# EAGLE design Goldfish-Voiceboard (EAGLE 6.5.0)

## Sheet 1 of 3
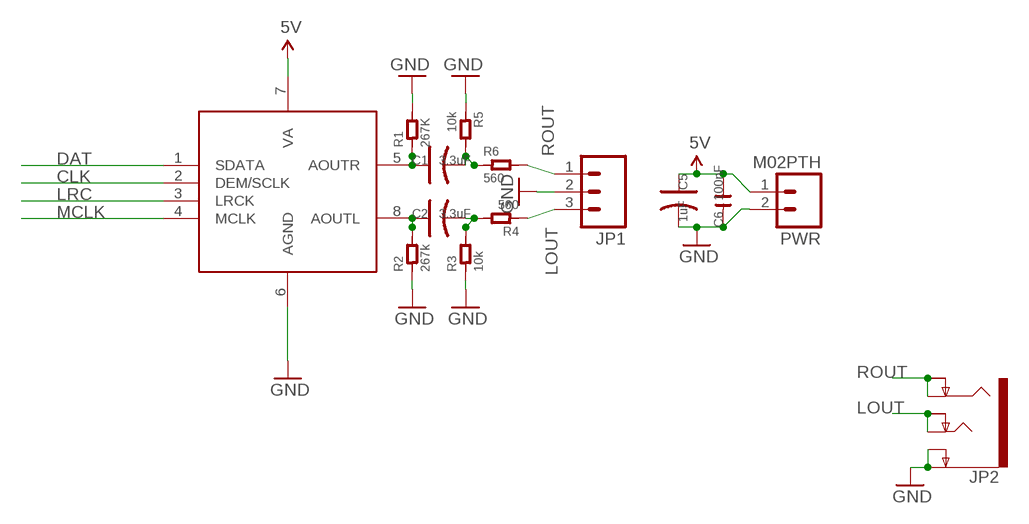
[diagram p0: schematic, sheet 1]

### Parts
C1  3.3uF  C-POLAR-A  [AVX-A]
C2  3.3uF  C-POLAR-A  [AVX-A]
C5  1uF  C-POLAR-A  [AVX-A]
C6  100nF  C-0603  [C0603]
JP1  M03PTH  [1X03]
JP2  AUDIO-JACK4-.25-HORIZ-TRS  [AUDIO-JACK-.25-INCH-HORIZ-PTH]
PWR  M02PTH  [1X02]
R1  267K  R-0603  [R0603]
R2  267k  R-0603  [R0603]
R3  10k  R-0603  [R0603]
R4  560  R-0603  [R0603]
R5  10k  R-0603  [R0603]
R6  560  R-0603  [R0603]
U$1  CS4335-KSZ  [SOIC8_208MIL]

### Nets
5V [5V]: C5.+ C6.2 PWR.1 U$1.7(VA) ; also sheet 2
CLK: U$1.2(DEM/SCLK) ; also sheet 2
DAT: U$1.1(SDATA) ; also sheet 2
GND: C5.- C6.1 JP1.2 JP2.P$2(EARTH) JP2.P$3(EARTH-NORM) PWR.2 R1.2 R2.1 R3.1 R5.1 U$1.6(AGND) ; also sheet 2
LOUT [MEDIUMAUDIO]: JP1.3 JP2.P$6(TIP) JP2.P$7(TIP-NORM) R4.1
LRC: U$1.3(LRCK) ; also sheet 2
MCLK: U$1.4(MCLK) ; also sheet 2
N$13 [MEDIUMAUDIO]: C1.+ R1.1 U$1.5(AOUTR)
N$14 [MEDIUMAUDIO]: C2.+ R2.2 U$1.8(AOUTL)
N$15 [MEDIUMAUDIO]: C2.- R3.2 R4.2
N$16 [MEDIUMAUDIO]: C1.- R5.2 R6.1
ROUT [MEDIUMAUDIO]: JP1.1 JP2.P$4(RING) JP2.P$5(RING-NORM) R6.2

## Sheet 2 of 3
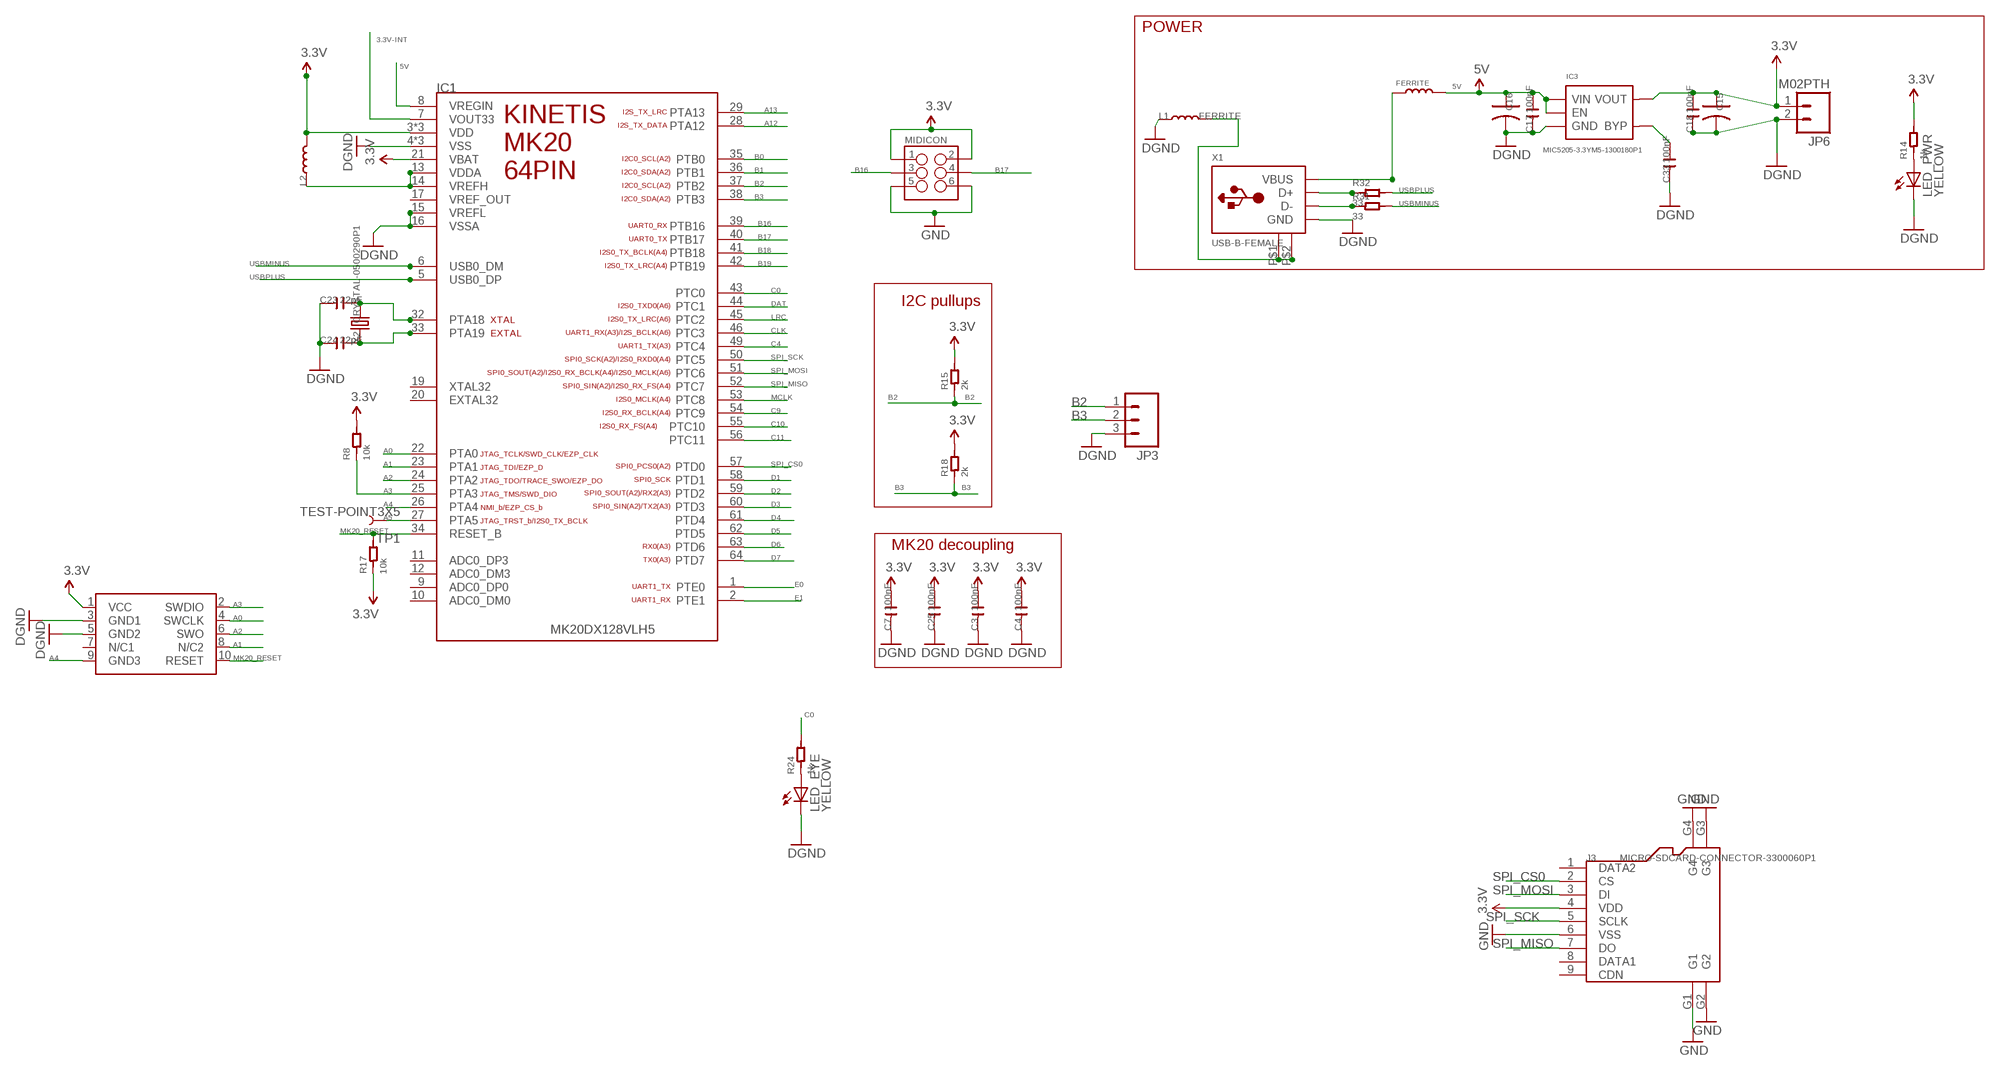
[diagram p1: schematic, sheet 2]

### Parts
C3  100nF  C-0603  [C0603]
C4  100nF  C-0603  [C0603]
C7  100nF  C-0603  [C0603]
C15  C-POLAR-A  [AVX-A]
C16  C-POLAR-A  [AVX-A]
C17  100nF  C-0603  [C0603]
C18  100nF  C-0603  [C0603]
C23  22pF  C-0603  [C0603]
C24  22pF  C-0603  [C0603]
C25  100nF  C-0603  [C0603]
C33  100nF  C-0603  [C0603]
IC1  MK20DX128VLH5  [MK20DX128VLH5]
IC3  MIC5205-3.3YM5-1300180P1  [SOT23-5]
J3  MICRO-SDCARD-CONNECTOR-3300060P1  [9P-SMD-W-RING]
JP3  M03PTH  [1X03]
JP6  M02PTH  [1X02]
L1  FERRITE  L-0603  [L0603]
L2  L-0603  [L0603]
L4  FERRITE  L-0603  [L0603]
LED_EYE  YELLOW  LEDCHIP-LED0603  [CHIP-LED0603]
LED_PWR  YELLOW  LEDCHIP-LED0603  [CHIP-LED0603]
MIDICON  M03X2SMT  [2X3_SMT_POSTS]
R8  10k  R-0603  [R0603]
R14  1k  R-0603  [R0603]
R15  2k  R-0603  [R0603]
R17  10k  R-0603  [R0603]
R18  2k  R-0603  [R0603]
R24  1k  R-0603  [R0603]
R31  33  R-0603  [R0603]
R32  33  R-0603  [R0603]
SWD1  CORTEX_SWD  [M50-3600542]
TP1  TEST-POINT3X5  [PAD.03X.05]
X1  USB-B-FEMALE  [FCI61729]
X2  CRYSTAL-0500290P1  [2P-SMD-5.0X3.2]

### Nets
3.3V: C3.2 C4.2 C7.2 C15.+ C18.2 C25.2 IC1.3(VDD) IC1.21(VBAT) IC1.30(VDD) IC1.48(VDD) IC3.5(VOUT) J3.4(VDD) JP6.1 L2.2 MIDICON.1 MIDICON.2 R8.2 R14.2 R15.2 R17.1 R18.2 SWD1.1(VCC)
3.3V-INT: IC1.7(VOUT33)
5V [5V]: C16.+ C17.2 IC1.8(VREGIN) IC3.1(VIN) IC3.3(EN) L4.2 ; also sheet 1
A0: IC1.22(PTA0) SWD1.4(SWCLK)
A1: IC1.23(PTA1) SWD1.8(N/C2)
A2: IC1.24(PTA2) SWD1.6(SWO)
A3: IC1.25(PTA3) R8.1 SWD1.2(SWDIO)
A4: IC1.26(PTA4) SWD1.9(GND3)
A5: IC1.27(PTA5) TP1.P$1
A12: IC1.28(PTA12)
A13: IC1.29(PTA13)
B0: IC1.35(PTB0)
B1: IC1.36(PTB1)
B2: IC1.37(PTB2) JP3.1 R15.1
B3: IC1.38(PTB3) JP3.2 R18.1
B16: IC1.39(PTB16) MIDICON.3
B17: IC1.40(PTB17) MIDICON.4
B18: IC1.41(PTB18)
B19: IC1.42(PTB19)
C0: IC1.43(PTC0) R24.2
C4: IC1.49(PTC4)
C9: IC1.54(PTC9)
C10: IC1.55(PTC10)
C11: IC1.56(PTC11)
CLK: IC1.46(PTC3) ; also sheet 1
D1: IC1.58(PTD1)
D2: IC1.59(PTD2)
D3: IC1.60(PTD3)
D4: IC1.61(PTD4)
D5: IC1.62(PTD5)
D6: IC1.63(PTD6)
D7: IC1.64(PTD7)
DAT: IC1.44(PTC1) ; also sheet 1
E0: IC1.1(PTE0)
E1: IC1.2(PTE1)
GND: C3.1 C4.1 C7.1 C15.- C16.- C17.1 C18.1 C23.1 C24.1 C25.1 C33.1 IC1.4(VSS) IC1.15(VREFL) IC1.16(VSSA) IC1.31(VSS) IC1.47(VSS) IC3.2(GND) J3.6(VSS) J3.G1 J3.G2 J3.G3 J3.G4 JP3.3 JP6.2 L1.1 LED_EYE.C LED_PWR.C MIDICON.5 MIDICON.6 SWD1.3(GND1) SWD1.5(GND2) X1.4(GND) ; supply symbol labelled DGND ; also sheet 1
LRC: IC1.45(PTC2) ; also sheet 1
MCLK: IC1.53(PTC8) ; also sheet 1
MK20_RESET: IC1.34(RESET_B) R17.2 SWD1.10(RESET)
N$3: L1.2 X1.P$1(GND1) X1.P$2(GND2)
N$4: LED_PWR.A R14.1
N$5 [5V]: L4.1 X1.1(VBUS)
N$9: C23.2 IC1.32(PTA18) X2.2
N$10: C24.2 IC1.33(PTA19) X2.1
N$12: C33.2 IC3.4(BYP)
N$17: LED_EYE.A R24.1
N$33: IC1.13(VDDA) IC1.14(VREFH) L2.1
SPI_CS0: IC1.57(PTD0) J3.2(CS)
SPI_MISO: IC1.52(PTC7) J3.7(DO)
SPI_MOSI: IC1.51(PTC6) J3.3(DI)
SPI_SCK: IC1.50(PTC5) J3.5(SCLK)
USB_N: R32.1 X1.3(D+)
USB_P: R31.1 X1.2(D-)
USBMINUS: IC1.6(USB0_DM) R31.2
USBPLUS: IC1.5(USB0_DP) R32.2
Unconnected: IC1.9(ADC0_DP0) IC1.10(ADC0_DM0) IC1.11(ADC0_DP3) IC1.12(ADC0_DM3) IC1.17(VREF_OUT) IC1.19(XTAL32) IC1.20(EXTAL32) J3.1(DATA2) J3.8(DATA1) J3.9(CDN) SWD1.7(N/C1)

### Notes on the sheet
- POWER
- I2C pullups
- MK20 decoupling

## Sheet 3 of 3
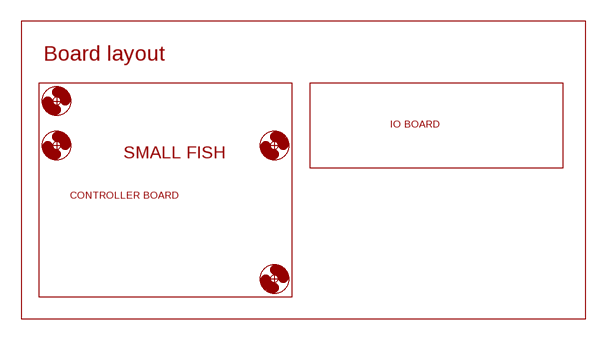
[diagram p2: schematic, sheet 3]

### Parts
H1  MOUNT-HOLE  [3.2-NOMARKINGS-SMALLSAFEZONE]
H4  MOUNT-HOLE  [3.2-NOMARKINGS-SMALLSAFEZONE]
H9  MOUNT-HOLE  [3.2-NOMARKINGS-SMALLSAFEZONE]
H10  MOUNT-HOLE  [3.2-NOMARKINGS-SMALLSAFEZONE]
U$11  FISH_SMALL  [FISH_SMALL]

### Notes on the sheet
- Board layout
- IO BOARD
- CONTROLLER BOARD

## Library data of the parts
C1 C2 C5 C15 C16 = OPL Eagle Library:C-POLAR*
C3 C4 C7 C17 C18 C23-C25 C33 = OPL Eagle Library:C*
C6 = OPL:C*
H1 H4 H9 H10 = zephod-components:MOUNT-HOLE: MOUNTING HOLE with drill center marker
IC1 = zephod-components:MK20DX128VLH5: Teensy 3.0 Processing Unit - MK20DX128VLH5 ARM Cortex M0 Datasheet: http://cache.freescale.com/files/32bit/doc/data_sheet/K20P64M50SF0.pdf
IC3 = OPL Eagle Library:MIC5205-3.3YM5: The MIC5205 is an efficient linear voltage regulator with ultra-low-noise output, very low dropout voltage (typically 17mV at light loads and 165mV at 150mA), and very low ground current (600µA at 100mA output). The MIC5205 offers better than 1% initial accuracy. datasheet here: http://www.micrel.com/product-info/prod/5205.shtml
J3 = OPL:MICRO-SDCARD-CONNECTOR: Micro SD Card
JP1 JP3 = SparkFun-Connectors:M03: Header 3 Standard 3-pin 0.1" header. Use with straight break away headers (SKU : PRT-00116), right angle break away headers (PRT-00553), swiss pins (PRT-00743), machine pins (PRT-00117), and female headers (PRT-00115). Molex polarized connector foot print use with SKU : PRT-08232 with associated crimp pins and housings.
JP2 = SparkFun-Connectors:AUDIO-JACK4-.25-HORIZ-TRS: 1/4" TRS jack, horizontal Production SKU: COM-11144 Footprint unproven - datasheet and part seem to be slightly different; PROD_ID: COM-11144
JP6 PWR = SparkFun-Connectors:M02: Standard 2-pin 0.1" header. Use with - straight break away headers ( PRT-00116) - right angle break away headers (PRT-00553) - swiss pins (PRT-00743) - machine pins (PRT-00117) - female headers (PRT-00115) Molex polarized connector foot print use with: PRT-08233 with associated crimp pins and housings. 2.54_SCREWTERM for use with PRT-10571. 3.5mm Screw Terminal footprints for PRT-08084 5mm Screw Terminal footprints for use with PRT-08433
L1 L2 L4 = OPL Eagle Library:L*
LED_EYE LED_PWR = adafruit:LED: LED OSRAM: - CHIPLED LG R971, LG N971, LY N971, LG Q971, LY Q971, LO R971, LY R971 LH N974, LH R974 LS Q976, LO Q976, LY Q976 LO Q996 - Hyper CHIPLED LW Q18S LB Q993, LB Q99A, LB R99A - SideLED LS A670, LO A670, LY A670, LG A670, LP A670 LB A673, LV A673, LT A673, LW A673 LH A674 LY A675 LS A676, LA A676, LO A676, LY A676, LW A676 LS A679, LY A679, LG A679 - Hyper Micro SIDELED® LS Y876, LA Y876, LO Y876, LY Y876 LT Y87S - SmartLED LW L88C, LW L88S LB L89C, LB L89S, LG L890 LS L89K, LO L89K, LY L89K LS L896, LA L896, LO L896, LY L896 - TOPLED LS T670, LO T670, LY T670, LG T670, LP T670 LSG T670, LSP T670, LSY T670, LOP T670, LYG T670 LG T671, LOG T671, LSG T671 LB T673, LV T673, LT T673, LW T673 LH T674 LS T676, LA T676, LO T676, LY T676, LB T676, LH T676, LSB T676, LW T676 LB T67C, LV T67C, LT T67C, LS T67K, LO T67K, LY T67K, LW E67C LS E67B, LA E67B, LO E67B, LY E67B, LB E67C, LV E67C, LT E67C LW T67C LS T679, LY T679, LG T679 LS T770, LO T770, LY T770, LG T770, LP T770 LB T773, LV T773, LT T773, LW T773 LH T774 LS E675, LA E675, LY E675, LS T675 LS T776, LA T776, LO T776, LY T776, LB T776 LHGB T686 LT T68C, LB T68C - Hyper Mini TOPLED® LB M676 - Mini TOPLED Santana® LG M470 LS M47K, LO M47K, LY M47K Source: http://www.osram.convergy.de/
MIDICON = zephod-components:M03X2: 2x3 .1" header. Shrouded, with keying- CONN-10681 SMT- CONN-11415 Pogo pins- HW-11044; PROD_ID: CONN-11415
R1-R6 R15 R18 = OPL:R*
R8 R14 R17 R24 R31 R32 = OPL Eagle Library:R*
SWD1 = carrilib with jtags:CORTEX_SWD: .05" Cortex M Connector in SWD mode Manufacturer: Generic Part Number: Cortex M SWD Notes: I use Harwin M50-3600542 connectors
TP1 = SparkFun-Passives:TEST-POINT: Bare copper test points for troubleshooting or ICT
U$1 = zephod-components:CS4335-KSZ
U$11 = zephod-components:FISH_SMALL
X1 = ld-components:USB-B-FEMALE: USB type B receptacle FCI 61729-59796
X2 = OPL Eagle Library:CRYSTAL*

## Net classes
1 GND: width 0.229 mm
2 5V: width 0.254 mm
3 MEDIUMAUDIO: width 0.381 mm

## Board
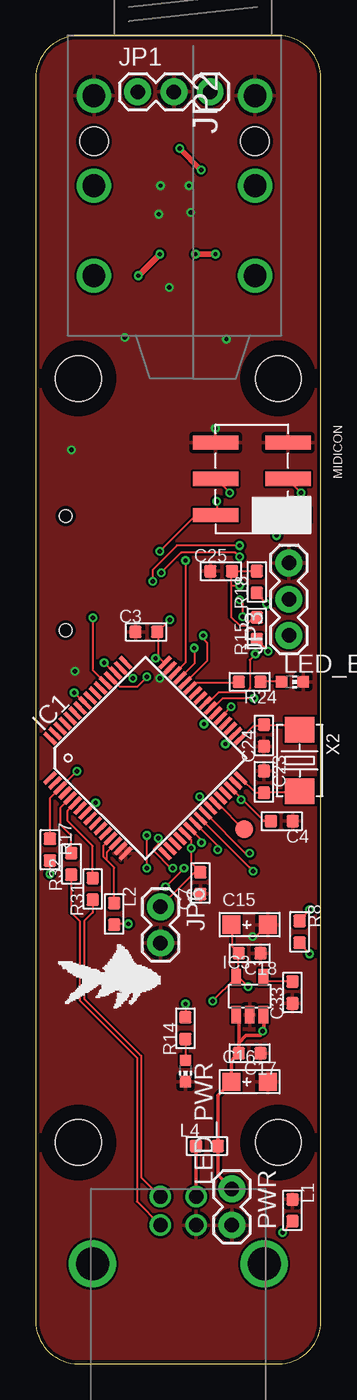
[diagram p3: board, top side]
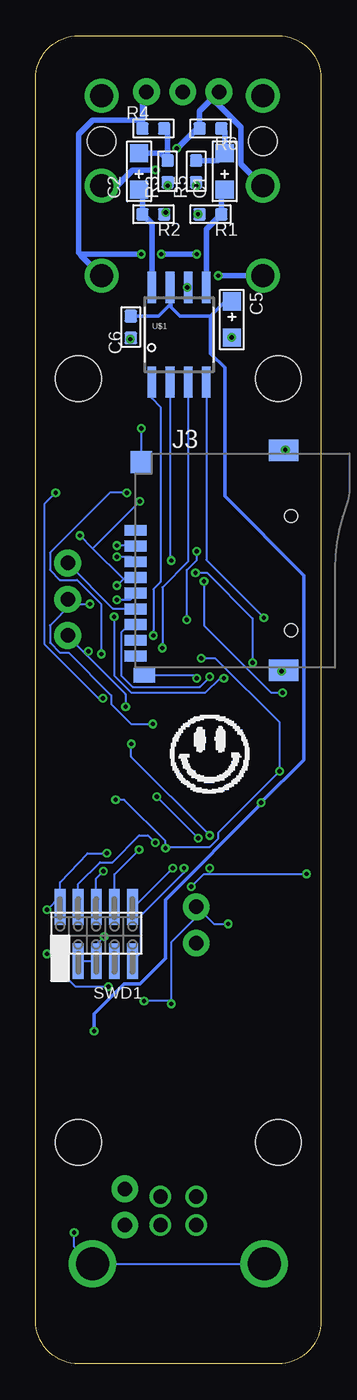
[diagram p4: board, bottom side, seen from below]

Size 20 x 93 mm. Coordinates in mm from the lower left corner, seen from the top.
Outline: 20,3 20,90 arc90 17,93 3,93 arc90 0,90 0,3 arc90 3,0 17,0 arc90 20,3
Copper layers (1*16): Top 0.035mm / dielectric 1.5mm / Bottom 0.035mm
Design rules "ITEADstudio_DRC": minimum track width 6mil, minimum drill 12mil, track to track 6mil, track to pad 6mil, pad to pad 6mil, via to via 6mil, smd to smd 0mil, copper to edge 10mil, drill to drill 10mil, minimum pad ring 10mil, minimum via ring 6mil, stop-mask expansion 2mil, vias tented up to drill 100mil, thermal gap 10mil

### Footprints (pad centres in the part's own frame; a part is rotated, then mirrored left to right if it is on the bottom)
AVX-A = smd 1.27 x 1.27: + -1.27,0; - 1.27,0
C0603 = smd 0.889 x 0.889: 1 -0.762,0; 2 0.762,0
3.2-NOMARKINGS-SMALLSAFEZONE = hole 3.2: 0,0
MK20DX128VLH5 = smd 1.1 x 0.285: 1 -5.605,3.385; 2 -5.605,2.885; 3 -5.605,2.385; 4 -5.605,1.885; 5 -5.605,1.385; 6 -5.605,0.885; 7 -5.605,0.385; 8 -5.605,-0.115; 9 -5.605,-0.615; 10 -5.605,-1.115; 11 -5.605,-1.615; 12 -5.605,-2.115; 13 -5.605,-2.615; 14 -5.605,-3.115; 15 -5.605,-3.615; 16 -5.605,-4.115; 33 5.795,-4.115; 34 5.795,-3.615; 35 5.795,-3.115; 36 5.795,-2.615; 37 5.795,-2.115; 38 5.795,-1.615; 39 5.795,-1.115; 40 5.795,-0.615; 41 5.795,-0.115; 42 5.795,0.385; 43 5.795,0.885; 44 5.795,1.385; 45 5.795,1.885; 46 5.795,2.385; 47 5.795,2.885; 48 5.795,3.385 | smd 0.285 x 1.1: 17 -3.655,-6.065; 18 -3.155,-6.065; 19 -2.655,-6.065; 20 -2.155,-6.065; 21 -1.655,-6.065; 22 -1.155,-6.065; 23 -0.655,-6.065; 24 -0.155,-6.065; 25 0.345,-6.065; 26 0.845,-6.065; 27 1.345,-6.065; 28 1.845,-6.065; 29 2.345,-6.065; 30 2.845,-6.065; 31 3.345,-6.065; 32 3.845,-6.065; 49 3.845,5.335; 50 3.345,5.335; 51 2.845,5.335; 52 2.345,5.335; 53 1.845,5.335; 54 1.345,5.335; 55 0.845,5.335; 56 0.345,5.335; 57 -0.155,5.335; 58 -0.655,5.335; 59 -1.155,5.335; 60 -1.655,5.335; 61 -2.155,5.335; 62 -2.655,5.335; 63 -3.155,5.335; 64 -3.655,5.335
SOT23-5 = smd 0.69 x 1.2: 1 -0.95,-1.3; 2 0,-1.3; 3 0.95,-1.3; 4 0.95,1.3; 5 -0.95,1.3
9P-SMD-W-RING = smd 1.524 x 0.762: 1 -7.493,2.114; 2 -7.493,1.014; 3 -7.493,-0.086; 4 -7.493,-1.186; 5 -7.493,-2.286; 6 -7.493,-3.386; 7 -7.493,-4.486; 8 -7.493,-5.586; 9 -7.493,-6.686 | smd 1.524 x 1.016: G1 -6.893,-8.032 | smd 2.032 x 1.524: G2 2.88,-7.686; G3 2.88,7.714 | smd 1.524 x 1.524: G4 -7.101,6.895 | hole 0.889: 3.407,-4.886; 3.407,3.114
1X03 = drill 1.016 pad 1.88: 1 0,0; 2 2.54,0; 3 5.08,0
AUDIO-JACK-.25-INCH-HORIZ-PTH = drill 1.6: P$2 4.2,-6.92; P$3 4.2,4.38; P$4 10.5,-6.92; P$5 10.5,4.38; P$6 16.8,-6.92; P$7 16.8,4.38 | hole 2: 7.4,4.38; 7.4,-6.92
1X02 = drill 1.016 pad 1.88: 1 0,0; 2 2.54,0
L0603 = smd 0.889 x 0.889: 1 -0.762,0; 2 0.762,0
CHIP-LED0603 = smd 0.8 x 0.8: A 0,-0.75; C 0,0.75
2X3_SMT_POSTS = smd 1 x 3.17: 1 -2.54,-2.54; 2 -2.54,2.54; 3 0,-2.54; 4 0,2.54; 5 2.54,-2.54; 6 2.54,2.54
R0603 = smd 0.889 x 0.889: 1 -0.762,0; 2 0.762,0
M50-3600542 = smd 0.75 x 2.5: 1 -2.54,-1.81; 2 -2.54,2; 3 -1.27,-1.81; 4 -1.27,2; 5 0,-1.81; 6 0,2; 7 1.27,-1.81; 8 1.27,2; 9 2.54,-1.81; 10 2.54,2
PAD.03X.05 = smd 1.27 x 1.27: P$1 0,0
SOIC8_208MIL = smd 0.6 x 2.2: 1 -1.905,-3.315; 2 -0.635,-3.315; 3 0.635,-3.315; 4 1.905,-3.315; 5 1.905,3.315; 6 0.635,3.315; 7 -0.635,3.315; 8 -1.905,3.315
FCI61729 = drill 1: 1 1.25,4.71; 2 -1.25,4.71; 3 -1.25,2.71; 4 1.25,2.71 | drill 2.3: P$1 -6.02,0; P$2 6.02,0
2P-SMD-5.0X3.2 = smd 1.778 x 2.032: 1 -2.159,0; 2 2.159,0

### Placement (x,y rotation side)
C1  6.75,83.5 90 bottom
C2  12.75,83.5 90 bottom
C3  7.75,51.25 0 top
C4  17.25,38 180 top
C5  6.25,73.12 270 bottom
C6  13.33,72.6 90 bottom
C7  11.54,33.66 90 top
C15  15,30.75 0 top
C16  15,19.75 0 top
C17  15,21.75 180 top
C18  15,28.75 180 top
C23  16,40.75 270 top
C24  16,44 90 top
C25  13,55.5 0 top
C33  18,26 90 top
H1  17,69 0 top
H4  17,15.5 90 top
H9  3,15.5 0 top
H10  3,69 0 top
IC1  7.36,42.6 45 top
IC3  15,25.75 0 top
J3  5.5,56.25 0 bottom
JP1  7.15,89.07 0 top
JP2  11,93 270 top
JP3  17.75,51 90 top
JP6  8.75,32 270 top
L1  18,10.75 270 top
L2  5.5,31.5 270 top
L4  12,15.25 0 top
LED_EYE  18,47.75 270 top
LED_PWR  10.5,20.5 180 top
MIDICON  15.15,61.97 90 top
PWR  13.75,12.25 270 top
R1  7.75,80.5 180 bottom
R2  11.75,80.5 180 bottom
R3  10.75,83.5 90 bottom
R4  11.75,86.5 0 bottom
R5  8.75,83.5 90 bottom
R6  7.75,86.5 180 bottom
R8  18.5,30.25 270 top
R14  10.5,23.5 90 top
R15  15.5,51.5 90 top
R17  1,36 270 top
R18  15.5,54.75 90 top
R24  15,47.75 180 top
R31  4,33.25 90 top
R32  2.5,35 90 top
SWD1  15.75,30 0 bottom
TP1  14.62,37.45 0 top
U$1  9.95,72.06 0 bottom
U$2  [ACIDSMILE]  7.75,42.75 0 bottom
U$11  6.94,26.94 0 top
X1  10,7 0 top
X2  18.5,42.25 270 top

### Tracks (layer width: path | path; a pad name or v marks a point on that pad's centre or on a via)
3.3V  (via drill 0.3)
  Top 0.152: R17.1 1,39.61 IC1.3 1.8,40.4 v2.9,41.5 | 10.92,36.1 10.92,35.08 11.62,34.38 11.5,34.25 C7.2 11.3,34.6 8.7,32 JP6.1 | 10.92,36.1 10.92,36.7 IC1.21 | C4.2 15.98,38 14.44,39.54 | 14.44,39.54 IC1.30 | 13.7,54.5 13.7,55.5 C25.2 R18.2 | 13.7,54.5 13.7,52.3 14.3,51.7 14.7,51.7 15.2,52.2 15.5,52.2 R15.2 | 13.7,54.5 v14.3,54.5 | v16.9,58 16.9,58.7 17.6,59.4 MIDICON.1 | v12.7,60.4 12.7,59.5 MIDICON.2 12.6,59.4 11.2,59.4 v8.7,56.9 | 8.65,49.45 9,49.1 IC1.48 | 8.65,49.45 8.6,49.5 8.6,51.2 C3.2 8.6,51.3 v9.4,52.1 | v8.4,49.4 8.6,49.4 8.65,49.45 | v19.2,28.7 18.5,29.4 R8.2 | IC3.5 14.1,27.1 14.2,27.2 14.2,28.7 C18.2 14.2,28.8 13.8,29.2 13.8,30.7 C15.+ | v14.9,26.4 14.2,27.1 IC3.5 | v6.5,30.8 5.5,30.8 L2.2 | v10.5,25.2 R14.2 | v14.4,39.5 14.44,39.54 | v10.9,36.1 10.92,36.1 | v12.4,25.4 14,27 IC3.5
  Bottom 0.152: v14.3,54.5 13.85,54.95 | 13.85,54.95 13.8,55 13,55 J3.4 | v16.9,58 16,57.1 | 16,57.1 13.85,54.95 | 16,57.1 v12.7,60.4 | v8.4,49.4 7.4,49.4 2.9,44.9 v2.9,41.5 7.2,37.2 7.2,36.8 7.8,36.2 10.9,36.2 | v19.2,28.7 18.8,28.7 SWD1.1 18.2,28.1 18.2,27.4 17.2,26.4 v14.9,26.4 | v6.5,30.8 7.5,30.8 8.7,32 JP6.1 8.4,31.6 10.5,29.5 10.5,25.4 | v14.4,39.5 13.8,39.5 10.9,36.6 10.9,36.2 | 10.5,25.4 v12.4,25.4 | 10.5,25.4 v10.5,25.2 | 10.9,36.2 v10.9,36.1 | v8.7,56.9 8.7,56.3 9.4,55.6 v9.4,52.1
5V  (via drill 0.3)
  Top 0.254: PWR.1 12.76,13.24 L4.2 12.76,18.78 C16.+ 13.73,21.24 C17.2 | C17.2 14.24,24.26 IC3.1 | C17.2 14.24,22.49 14.75,23 15.75,23 15.97,23.23 | 15.97,23.23 16,23.25 16,24.4 IC3.3 | v4.2,39.3 3.5,38.6 IC1.8 | v15.9,23.3 15.97,23.23
  Bottom 0.254: C5.+ 6.74,74.39 7.75,73.38 | 7.75,73.38 9.88,73.38 10.5,74 10.5,74.25 | 10.5,74.25 10.5,75.29 U$1.7 | C6.2 11.39,73.36 10.5,74.25 | 7.75,73.38 7.75,70.75 6.75,69.75 6.75,60.75 1.2,55.2 1.2,42.3 v4.2,39.3 4.2,39.2 10.9,32.5 10.9,28.4 12.7,26.6 13.8,26.6 15.9,24.5 v15.9,23.3
A0  (via drill 0.3)
  Top 0.152: v11.62,36.5 11.7,36.62 IC1.22
  Bottom 0.152: SWD1.4 17.02,33.6 15.5,35.12 14.62,35.12 12.75,37 12.12,37 v11.62,36.5
A1  (via drill 0.3)
  Top 0.152: v12.75,36 12.78,36.25 IC1.23
  Bottom 0.152: SWD1.8 14.48,34.27 v12.75,36
A2  (via drill 0.3)
  Top 0.152: v15.25,34.5 14.99,34.75 IC1.24
  Bottom 0.152: SWD1.6 15.75,34 v15.25,34.5
A3  (via drill 0.3)
  Top 0.152: v15,35.75 14.7,35.75 IC1.25 | v19.2,31.8 18.5,31.1 R8.1
  Bottom 0.152: v15,35.75 16.38,35.75 18.29,33.71 SWD1.2 18.3,32.7 v19.2,31.8
A4  (via drill 0.3)
  Top 0.152: v11.5,39.7 12.2,39 IC1.26 | v8.6,36.8 8.6,36.4 8.3,36.1 8.3,35.9 9.5,34.7 v9.6,34.7
  Bottom 0.152: v8.6,36.8 v11.5,39.7 | v9.6,34.7 9.6,34.4 12.6,31.4 12.6,28.8 SWD1.9
A5
  Top 0.152: IC1.27 12.6,39.2 12.8,39.2 14.6,37.4 TP1.P$1
B2  (via drill 0.3)
  Top 0.152: v16.3,49.9 15.5,50.7 R15.1 | v13.7,46 13,45.3 IC1.37
  Bottom 0.152: 16.7,49.9 v16.3,49.9 | 16.7,49.9 17.8,51 JP3.1 | v13.7,46 13.7,46.9 16.7,49.9
B3  (via drill 0.3)
  Top 0.152: v16.2,53.2 15.5,53.9 R18.1 | v11.8,44.8 12.5,45.5 IC1.38
  Bottom 0.152: v16.2,53.2 17.4,53.2 17.7,53.5 JP3.2 17.5,53.2 19,51.7 19,50.5 18.3,49.8 17.7,49.8 14.7,46.8 14.7,46.2 13.3,44.8 v11.8,44.8
B16  (via drill 0.3)
  Top 0.152: v15.3,46.6 13.1,46.6 12.5,46 12.3,46 IC1.39 | v18.6,61 17.7,61.9 MIDICON.3
  Bottom 0.152: v15.3,46.6 15.6,46.6 19.4,50.4 19.4,60.2 v18.6,61
B17  (via drill 0.3)
  Top 0.152: v15.4,49.7 15,49.3 15,47.3 14.7,47 12.8,47 12.1,46.3 11.9,46.3 IC1.40 | v13.6,61 12.7,61.9 MIDICON.4
  Bottom 0.152: v15.4,49.7 15.4,53.2 17.1,54.9 18.3,54.9 19,55.6 19,56.8 14.8,61 v13.6,61
C0
  Top 0.152: R24.2 14.2,47.7 11.2,47.7 10.9,47.4 IC1.43
CLK  (via drill 0.3)
  Top 0.152: v10.5,56.25 10.5,49.11 IC1.46
  Bottom 0.152: U$1.2 10.59,56.34 v10.5,56.25
DAT  (via drill 0.3)
  Top 0.152: v11.75,51 11.75,50.75 12,50.5 12,49.2 IC1.44
  Bottom 0.152: U$1.1 11.86,67.61 11.25,67 11.25,54.75 11.75,54.25 v11.75,51
GND  (via drill 0.3)
  Top 0.152: v8.7,48 9.4,48.7 IC1.47 | v12.6,65.5 12.6,64.6 MIDICON.6 | v15.2,29.9 15.4,29.9 16.2,30.7 C15.-
  Bottom 0.152: SWD1.3 17,28.2 15.8,28.2 SWD1.5 15.7,28.2 15.7,29.4 v15.2,29.9 | C6.1 13.3,71.8 v13.38,71.75 | v8.62,80.5 8.6,80.5 R1.2 | R5.1 8.8,82.7 8.8,82.5 v8.75,82.5 | R2.1 10.9,80.5 10.9,80.6 v10.88,80.62 | R3.1 10.8,82.7 10.8,82.5 v10.75,82.5 | C5.- 6.3,71.9 v6.25,71.88 | v8.7,48 8.9,48.2 12.3,48.2 J3.G1 | J3.6 13,52.9 14.6,52.9 17.7,56 JP3.3 | v12.6,65.5 12.6,63.2 J3.G4 | J3.G2 2.7,48.5 v2.75,48.5 | v2.5,64 2.6,64 J3.G3 | U$1.6 9.4,75.4 v9.38,75.38
  pour Top: 20,90 20,3 arc-90 17,0 3,0 arc-90 0,3 0,90 arc-90 3,93 17,93 arc-90
LOUT  (via drill 0.3)
  Top 0.381: v8.7,77.7 v7.2,76.2 | v12.6,77.7 v11.2,77.7
  Bottom 0.381: R4.1 12.51,87.1 | 12.51,87.1 12.51,88.79 JP1.3 | 12.51,87.1 16,87.1 17,86.1 17,77.8 16.8,77.6 | 16.8,77.6 15.4,76.2 JP2.P$7 | v7.2,76.2 JP2.P$6 | v11.2,77.7 v8.7,77.7 | v12.6,77.7 16.7,77.7 16.8,77.6
LRC  (via drill 0.3)
  Top 0.152: v11.12,50.12 11.12,49.03 IC1.45
  Bottom 0.152: U$1.3 9.31,56.19 11.12,54.38 v11.12,50.12
MCLK  (via drill 0.3)
  Top 0.152: v4,52.25 4,48.57 IC1.53
  Bottom 0.152: U$1.4 8.04,56.3 v4,52.25
MK20_RESET  (via drill 0.3)
  Top 0.152: v1,34.3 R17.2 | v10.4,34.7 v9.1,33.4 | v13.3,43.4 14,44.1 IC1.34 | v7.8,34.7 v7.8,37
  Bottom 0.152: 7.8,34.3 8.2,34.3 v9.1,33.4 | 7.8,34.3 v1,34.3 | v10.4,34.7 13.1,32 SWD1.10 | v13.3,43.4 13.3,42.5 v7.8,37 | 7.8,34.3 v7.8,34.7
N$3  (via drill 0.3)
  Top 0.152: v17.3,9.2 18,9.9 L1.2
  Bottom 0.152: v17.3,9.2 17.3,8.2 16.1,7 X1.P$2 X1.P$1
N$4
  Top 0.152: R14.1 LED_PWR.A
N$5
  Top 0.254: X1.1 11.25,15.24 L4.1
N$9
  Top 0.152: C23.2 15.4,40 14.4,41 IC1.32 | C23.2 18.5,40 X2.2 | C23.2
N$10
  Top 0.152: 16,44.7 15.3,44.7 14.4,43.8 IC1.33 | 16,44.7 18.3,44.7 18.5,44.5 X2.1 | 16,44.7 C24.2
N$12
  Top 0.152: C33.2 18,26.8 16.2,26.8 16,27 IC3.4
N$13
  Bottom 0.381: U$1.5 8.04,79.44 R1.1 6.99,81.99 C1.+
N$14
  Bottom 0.381: U$1.8 11.86,79.84 R2.2 12.51,81.99 C2.+
N$15
  Bottom 0.381: R4.2 10.75,86.26 R3.2 11.26,84.77 C2.-
N$16
  Bottom 0.381: R5.2 7.26,84.26 C1.- 6.75,86.26 R6.1
N$17
  Top 0.152: LED_EYE.A 17.2,47.8 15.8,47.8 R24.1
N$33
  Top 0.152: L2.1 5.5,34.75 5,35.25 | 5,35.25 4.75,35.5 4.75,36.29 IC1.13 | 5,35.25 5,35.84 IC1.14
ROUT  (via drill 0.3)
  Top 0.381: v10.1,85.1 v11.6,83.6
  Bottom 0.381: JP2.P$4 4.1,82.5 5.6,84 5.6,86.6 7.5,88.5 JP1.1 8.51,87.71 R6.2 8.7,86.5 v10.1,85.1 | JP2.P$5 14.3,82.5 13.2,83.6 v11.6,83.6
SPI_CS0  (via drill 0.3)
  Top 0.152: v2.7,47 3.4,46.3 IC1.57 | v8.2,54.8 8.2,55.6 9.9,57.3 v14.3,57.3
  Bottom 0.152: v2.7,47 3.5,47 8.2,51.7 v8.2,54.8 | v14.3,57.3 13,57.3 J3.2
SPI_MISO  (via drill 0.3)
  Top 0.152: v7.8,48.1 7.1,47.4 5.9,47.4 5.3,48 IC1.52
  Bottom 0.152: v7.8,48.1 8.5,47.4 13.2,47.4 14,48.2 14,51.2 13.5,51.7 13,51.7 J3.7
SPI_MOSI  (via drill 0.3)
  Top 0.152: v4.8,49.1 5.5,48.4 IC1.51 | v8.8,55.4 10.2,56.8 14,56.8 v14.3,56.5
  Bottom 0.152: v4.8,49.1 4.8,52.2 8,55.4 v8.8,55.4 | v14.3,56.5 13.3,56.5 13,56.2 J3.3
SPI_SCK  (via drill 0.3)
  Top 0.152: v6.8,48 6.7,48 6,48.7 IC1.50 | v14.5,52.3 14.5,53.3 v14.3,53.5
  Bottom 0.152: v6.8,48 7.1,48 8.1,47 13.3,47 14.5,48.2 v14.5,52.3 | v14.3,53.5 13.4,53.5 13,53.9 J3.5
USB_N
  Top 0.152: R32.1 2.5,31.6 3.1,31 3.1,25.44 7.1,21.44 7.1,11.36 X1.3
USB_P
  Top 0.152: R31.1 4,31.6 3.4,31 3.4,25.56 7.4,21.56 7.4,13.06 X1.2
USBMINUS
  Top 0.152: R31.2 4,36.25 2.25,38 2.25,38.74 IC1.6
USBPLUS
  Top 0.152: R32.2 2.5,37 1.75,37.75 1.75,38.95 IC1.5